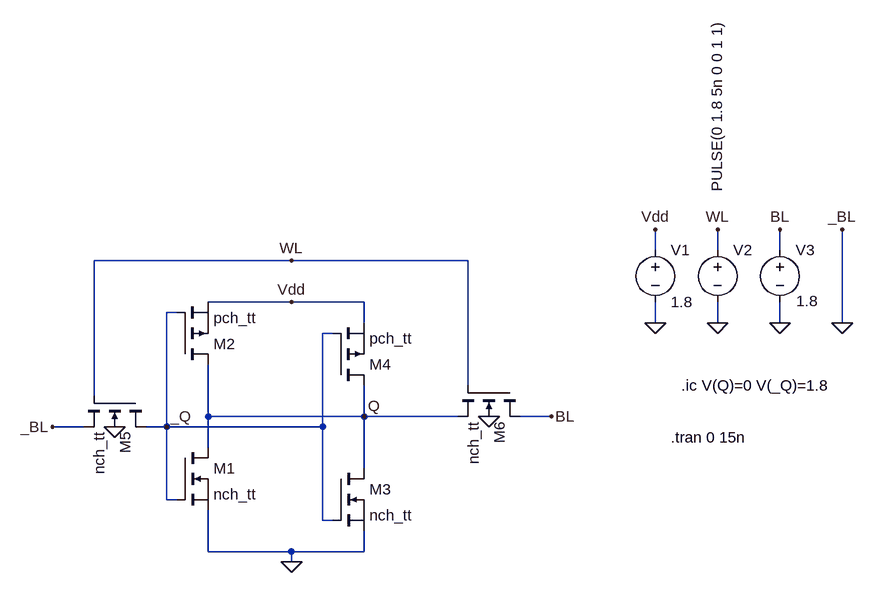
[diagram p0: schematic Q1.asc]
Q1.asc, the LTspice schematic file:
Version 4
SHEET 1 1516 680
WIRE 768 -176 768 -208
WIRE 864 -176 864 -208
WIRE 960 -176 960 -208
WIRE 208 -160 -96 -160
WIRE 480 -160 208 -160
WIRE 208 -96 80 -96
WIRE 320 -96 208 -96
WIRE 32 -80 16 -80
WIRE 320 -64 320 -96
WIRE 768 -64 768 -96
WIRE 864 -64 864 -96
WIRE 960 -64 960 -96
WIRE 1056 -64 1056 -208
WIRE 272 -48 256 -48
WIRE 480 32 480 -160
WIRE -96 48 -96 -160
WIRE 80 80 80 0
WIRE 320 80 320 32
WIRE 320 80 80 80
WIRE 464 80 320 80
WIRE 608 80 560 80
WIRE -112 96 -160 96
WIRE 16 96 16 -80
WIRE 16 96 -16 96
WIRE 256 96 256 -48
WIRE 256 96 16 96
WIRE 80 128 80 80
WIRE 320 160 320 80
WIRE 16 208 16 96
WIRE 32 208 16 208
WIRE 256 240 256 96
WIRE 272 240 256 240
WIRE 80 288 80 224
WIRE 208 288 80 288
WIRE 320 288 320 256
WIRE 320 288 208 288
WIRE 208 304 208 288
FLAG 208 304 0
FLAG 768 -64 0
FLAG 864 -64 0
FLAG 960 -64 0
FLAG 1056 -64 0
FLAG 608 80 BL
FLAG 960 -208 BL
FLAG -160 96 _BL
FLAG 1056 -208 _BL
FLAG 864 -208 WL
FLAG 208 -160 WL
FLAG 208 -96 Vdd
FLAG 768 -208 Vdd
FLAG 320 80 Q
FLAG 16 96 _Q
FLAG -64 96 0
FLAG 512 80 0
SYMBOL nmos 272 160 R0
SYMATTR InstName M3
SYMATTR Value nch_tt
SYMATTR Value2 W = 720n L = 180n
SYMBOL nmos 32 128 R0
SYMATTR InstName M1
SYMATTR Value nch_tt
SYMATTR Value2 W = 720n L = 180n
SYMBOL voltage 768 -192 R0
WINDOW 123 0 0 Left 0
WINDOW 39 0 0 Left 0
SYMATTR InstName V1
SYMATTR Value 1.8
SYMBOL voltage 864 -192 R0
WINDOW 3 -1 -74 VLeft 2
WINDOW 123 0 0 Left 0
WINDOW 39 0 0 Left 0
SYMATTR InstName V2
SYMATTR Value PULSE(0 1.8 5n 0 0 1 1)
SYMBOL voltage 960 -192 R0
WINDOW 3 25 94 Left 2
WINDOW 123 0 0 Left 0
WINDOW 39 0 0 Left 0
SYMATTR InstName V3
SYMATTR Value 1.8
SYMBOL nmos4 -16 48 R90
SYMATTR InstName M5
SYMATTR Value nch_tt
SYMATTR Value2 W = 360n L = 180n
SYMBOL nmos4 560 32 R90
SYMATTR InstName M6
SYMATTR Value nch_tt
SYMATTR Value2 W = 360n L = 180n
SYMBOL pmos 272 32 M180
SYMATTR InstName M4
SYMATTR Value pch_tt
SYMATTR Value2 W = 270n L = 270n
SYMBOL pmos 32 0 M180
SYMATTR InstName M2
SYMATTR Value pch_tt
SYMATTR Value2 W = 270n L = 270n
TEXT 792 112 Left 2 !.tran 0 15n
TEXT 808 32 Left 2 !.ic V(Q)=0 V(_Q)=1.8

The netlist it stands for:
* Q1.asc
M3 Q _Q 0 0 nch_tt W = 720n L = 180n
M1 Q _Q 0 0 nch_tt W = 720n L = 180n
V1 Vdd 0 1.8
V2 WL 0 PULSE(0 1.8 5n 0 0 1 1)
V3 BL 0 1.8
M5 _Q WL 0 0 nch_tt W = 360n L = 180n
M6 BL WL Q 0 nch_tt W = 360n L = 180n
M4 Q _Q Vdd Vdd pch_tt W = 270n L = 270n
M2 Q _Q Vdd Vdd pch_tt W = 270n L = 270n
.model NMOS NMOS
.model PMOS PMOS
.lib standard.mos
.tran 0 15n
.ic V(Q)=0 V(_Q)=1.8
.backanno
.end

* Results of the author's LTspice run, read from the files saved beside the schematic
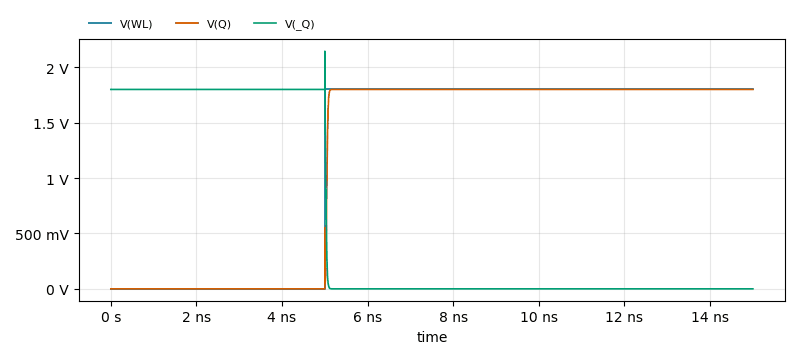
[diagram p1: Transient Analysis of Q1.asc, plotted from the saved traces]
* Transient Analysis, 1 run:
*   V(WL): min 0 V, max 1.8 V, average 1.2 V, rms 1.47 V, last 1.8 V
*   V(Q): min 0 V, max 1.8 V, average 1.194 V, rms 1.465 V, last 1.8 V
*   V(_Q): min 0 V, max 2.145 V, average 603.5 mV, rms 1.041 V, last 0 V